# EAGLE schematic Project1 (EAGLE 9.3.0)
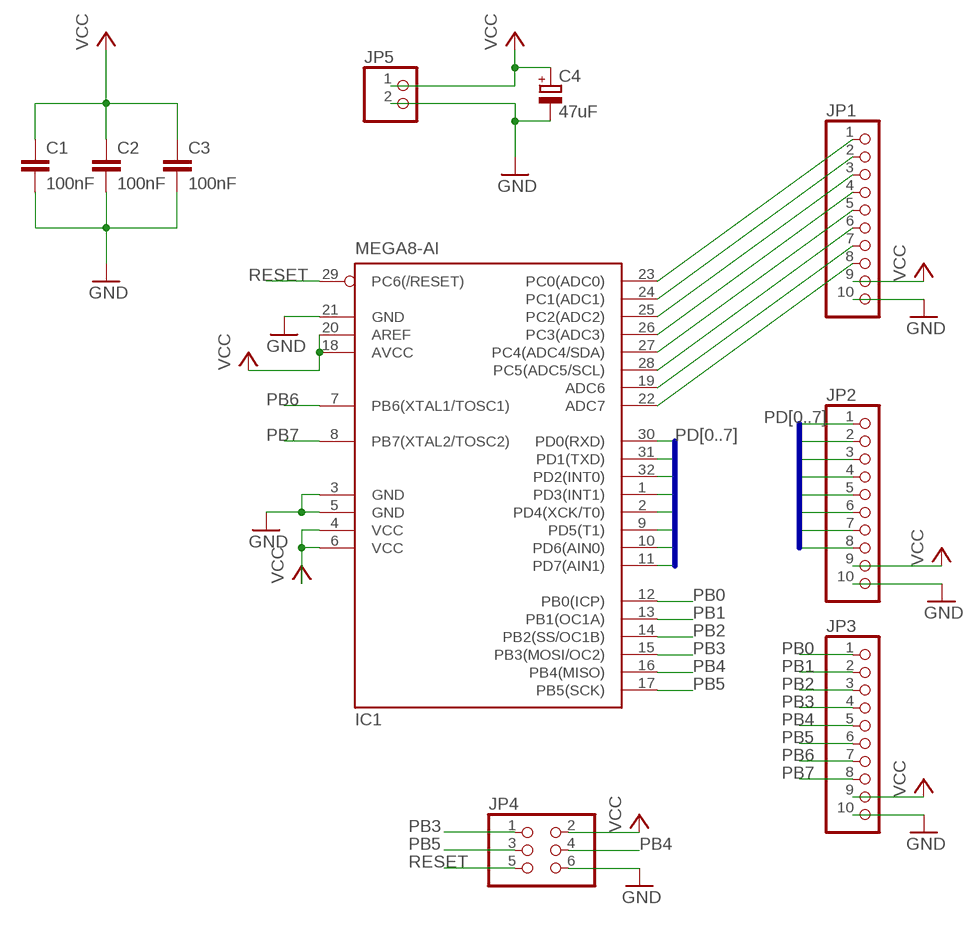
[diagram p0: schematic, sheet 1]

## Parts
C1  100nF  C-EUC0603  [C0603]
C2  100nF  C-EUC0603  [C0603]
C3  100nF  C-EUC0603  [C0603]
C4  47uF  CPOL-EUE2.5-6  [E2,5-6]
IC1  MEGA8-AI  [TQFP32-08]
JP1  PINHD-1X10  [1X10]
JP2  PINHD-1X10  [1X10]
JP3  PINHD-1X10  [1X10]
JP4  PINHD-2X3  [2X03]
JP5  PINHD-1X2  [1X02]

## Nets
GND: C1.2 C2.2 C3.2 C4.- IC1.3(GND) IC1.5(GND) IC1.21(GND) JP1.10 JP2.10 JP3.10 JP4.6 JP5.2
N$1: IC1.23(PC0(ADC0)) JP1.1
N$2: IC1.24(PC1(ADC1)) JP1.2
N$3: IC1.25(PC2(ADC2)) JP1.3
N$4: IC1.26(PC3(ADC3)) JP1.4
N$5: IC1.27(PC4(ADC4/SDA)) JP1.5
N$6: IC1.28(PC5(ADC5/SCL)) JP1.6
N$7: IC1.19(ADC6) JP1.7
N$8: IC1.22(ADC7) JP1.8
PB0: IC1.12(PB0(ICP)) JP3.1
PB1: IC1.13(PB1(OC1A)) JP3.2
PB2: IC1.14(PB2(SS/OC1B)) JP3.3
PB3: IC1.15(PB3(MOSI/OC2)) JP3.4 JP4.1
PB4: IC1.16(PB4(MISO)) JP3.5 JP4.4
PB5: IC1.17(PB5(SCK)) JP3.6 JP4.3
PB6: IC1.7(PB6(XTAL1/TOSC1)) JP3.7
PB7: IC1.8(PB7(XTAL2/TOSC2)) JP3.8
PD0: IC1.30(PD0(RXD)) JP2.1
PD1: IC1.31(PD1(TXD)) JP2.2
PD2: IC1.32(PD2(INT0)) JP2.3
PD3: IC1.1(PD3(INT1)) JP2.4
PD4: IC1.2(PD4(XCK/T0)) JP2.5
PD5: IC1.9(PD5(T1)) JP2.6
PD6: IC1.10(PD6(AIN0)) JP2.7
PD7: IC1.11(PD7(AIN1)) JP2.8
RESET: IC1.29(PC6(/RESET)) JP4.5
VCC: C1.1 C2.1 C3.1 C4.+ IC1.4(VCC) IC1.6(VCC) IC1.18(AVCC) IC1.20(AREF) JP1.9 JP2.9 JP3.9 JP4.2 JP5.1

## Buses
PD[0..7]

## Library data of the parts
C1-C3 = rcl:C-EU: CAPACITOR, European symbol; SPICEPREFIX: C
C4 = rcl:CPOL-EU: POLARIZED CAPACITOR, European symbol; SPICEPREFIX: C
IC1 = atmel:MEGA8: MICROCONTROLLER 8 Kbytes FLASH, 1 kbytes SRAM, 512 bytes EEPROM, USART, 6-channel 10 bit ADC, 2-channel 8 bit ADC Pin compatible with Atmega48, ATMega88, ATMega168 Source: avr.lbr; MPN: ATMEGA8-16AU; OC_FARNELL: 9171371; OC_NEWARK: 73M8863
JP1-JP3 = pinhead:PINHD-1X10: PIN HEADER
JP4 = pinhead:PINHD-2X3: PIN HEADER
JP5 = pinhead:PINHD-1X2: PIN HEADER